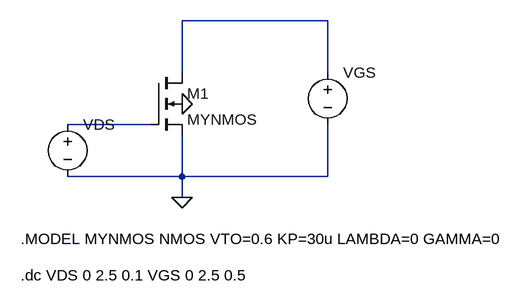
[diagram p0: schematic Lab 6 Part 1.asc]
Lab 6 Part 1.asc, the LTspice schematic file:
Version 4
SHEET 1 880 680
WIRE 352 -32 128 -32
WIRE 128 48 128 -32
WIRE 352 48 352 -32
WIRE 80 128 -48 128
WIRE 128 208 128 144
WIRE 128 208 -48 208
WIRE 352 208 352 128
WIRE 352 208 128 208
WIRE 128 240 128 208
FLAG 128 240 0
FLAG 128 96 0
SYMBOL nmos4 80 48 R0
SYMATTR InstName M1
SYMATTR Value MYNMOS
SYMBOL voltage -48 112 R0
SYMATTR InstName VDS
SYMATTR Value ""
SYMBOL voltage 352 32 R0
SYMATTR InstName VGS
SYMATTR Value ""
TEXT -120 304 Left 2 !.MODEL MYNMOS NMOS VTO=0.6 KP=30u LAMBDA=0 GAMMA=0
TEXT -120 360 Left 2 !.dc VDS 0 2.5 0.1 VGS 0 2.5 0.5

The netlist it stands for:
* Lab 6 Part 1.asc
M1 N001 N002 0 0 MYNMOS
VDS N002 0
VGS N001 0
.model NMOS NMOS
.model PMOS PMOS
.lib standard.mos
.MODEL MYNMOS NMOS VTO=0.6 KP=30u LAMBDA=0 GAMMA=0
.dc VDS 0 2.5 0.1 VGS 0 2.5 0.5
.backanno
.end